# Altium project 宝宝驱动板_V8.PrjPcb
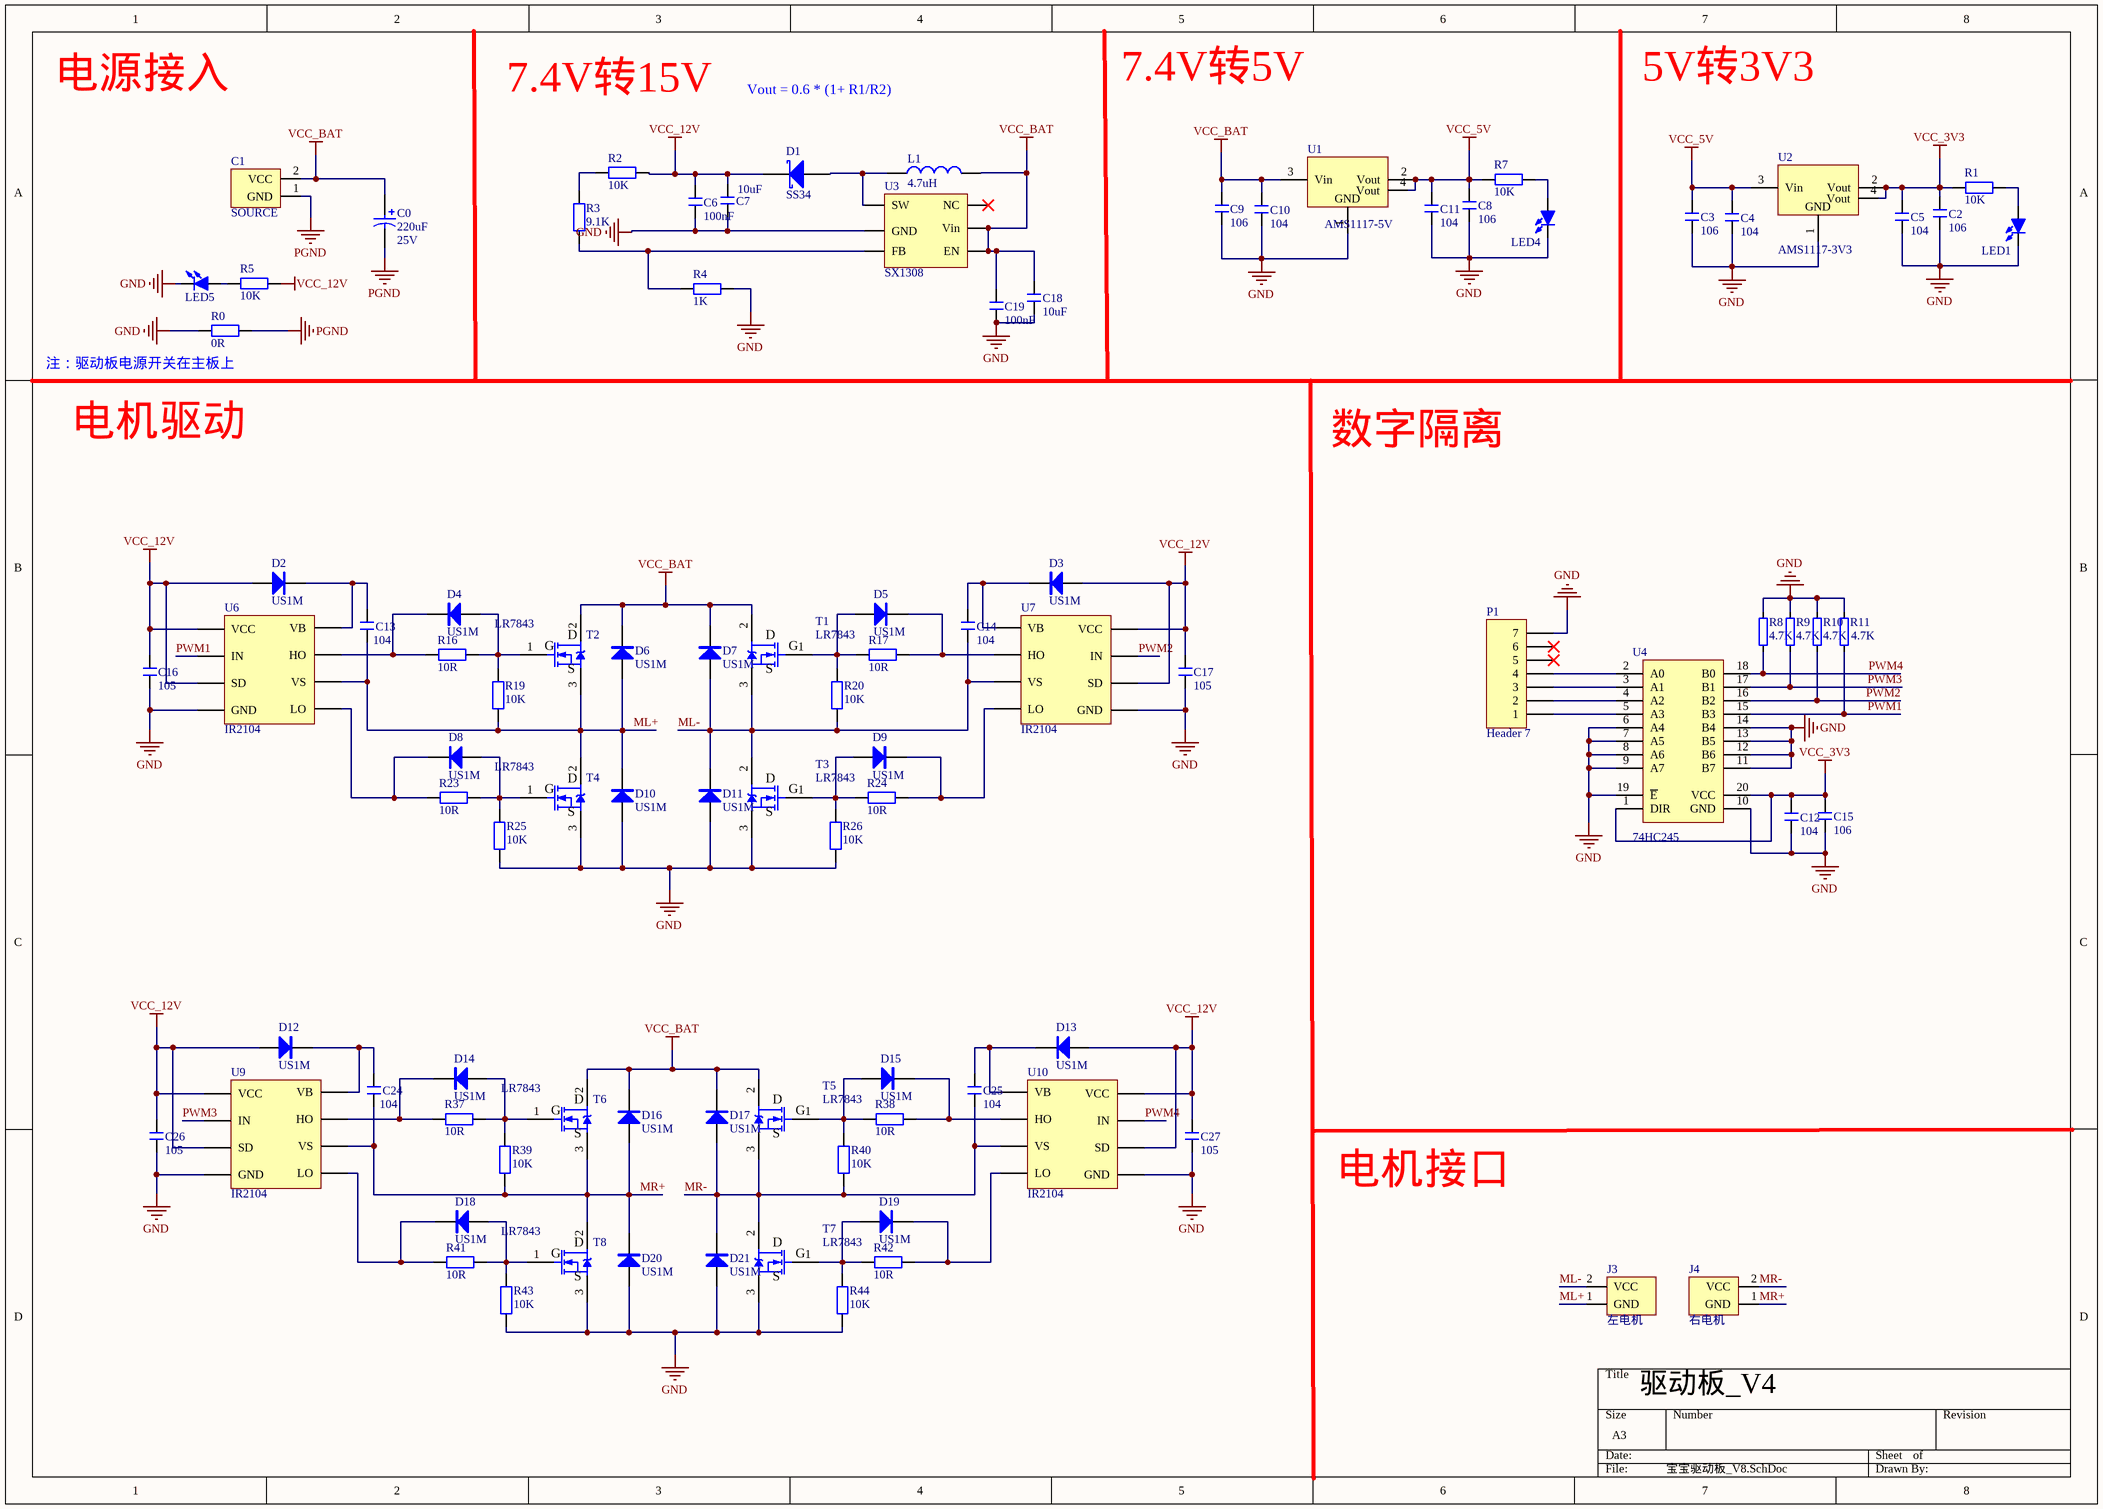
[diagram p0: 宝宝驱动板_V8.SchDoc]
1 sheet, 95 parts. Net scope: global (net labels, ports and power ports of the same name join across sheets).
Board file: 宝宝驱动板_V8.PcbDoc

## Sheet 宝宝驱动板_V8.SchDoc
size A3

### Parts
C0  value 220uF  Voltage: 25V  [CAPPR3.5-8X11.5]  (hidden comment: 220uF 25V)
C1  SOURCE  [KF128-5.08-2P]
C2  106  [C 0603_M]
C3  106  [C 0603_M]
C4  104  [C 0603_M]
C5  104  [C 0603_M]
C6  100nF  [C 0603_M]
C7  10uF  [C 0603_M]
C8  106  [C 0603_M]
C9  106  [C 0603_M]
C10  104  [C 0603_M]
C11  104  [C 0603_M]
C12  104  [C 0603_M]
C13  104  [C 0603_M]
C14  104  [C 0603_M]
C15  106  [C 0603_M]
C16  105  [C 0603_M]
C17  105  [C 0603_M]
C18  10uF  [C 0603_M]
C19  100nF  [C 0603_M]
C24  104  [C 0603_M]
C25  104  [C 0603_M]
C26  105  [C 0603_M]
C27  105  [C 0603_M]
D1  SS34  [SMA]
D2  US1M  [SMA]
D3  US1M  [SMA]
D4  US1M  [SMA]
D5  US1M  [SMA]
D6  US1M  [SMA]
D7  US1M  [SMA]
D8  US1M  [SMA]
D9  US1M  [SMA]
D10  US1M  [SMA]
D11  US1M  [SMA]
D12  US1M  [SMA]
D13  US1M  [SMA]
D14  US1M  [SMA]
D15  US1M  [SMA]
D16  US1M  [SMA]
D17  US1M  [SMA]
D18  US1M  [SMA]
D19  US1M  [SMA]
D20  US1M  [SMA]
D21  US1M  [SMA]
J3  左电机  [KF128-5.08-2P]
J4  右电机  [KF128-5.08-2P]
L1  4.7uH  [L 7*7]
LED1  红色  [LED 0603]  (value not drawn)
LED4  红色  [LED 0603]  (value not drawn)
LED5  红色  [LED 0603]  (value not drawn)
P1  Header 7  [PH2.0-L-Z-7P]
R0  value 0R  [R 2512_M]  (hidden comment: R)
R1  10K  [R 0603_M]
R2  10K  [R 0603_M]
R3  9.1K  [R 0603_M]
R4  1K  [R 0603_M]
R5  10K  [R 0603_M]
R7  10K  [R 0603_M]
R8  4.7K  [R 0603_M]
R9  4.7K  [R 0603_M]
R10  4.7K  [R 0603_M]
R11  4.7K  [R 0603_M]
R16  10R  [R 0603_M]
R17  10R  [R 0603_M]
R19  10K  [R 0603_M]
R20  10K  [R 0603_M]
R23  10R  [R 0603_M]
R24  10R  [R 0603_M]
R25  10K  [R 0603_M]
R26  10K  [R 0603_M]
R37  10R  [R 0603_M]
R38  10R  [R 0603_M]
R39  10K  [R 0603_M]
R40  10K  [R 0603_M]
R41  10R  [R 0603_M]
R42  10R  [R 0603_M]
R43  10K  [R 0603_M]
R44  10K  [R 0603_M]
T1  LR7843  [TO252]
T2  LR7843  [TO252]
T3  LR7843  [TO252]
T4  LR7843  [TO252]
T5  LR7843  [TO252]
T6  LR7843  [TO252]
T7  LR7843  [TO252]
T8  LR7843  [TO252]
U1  AMS1117-5V  [SOT223_L]
U2  AMS1117-3V3  [SOT223_L]
U3  SX1308  [SOT23-6]
U4  74HC245  [SOP20Z_M]
U6  IR2104  [SOP8]
U7  IR2104  [SOP8]
U9  IR2104  [SOP8]
U10  IR2104  [SOP8]

### Nets
GND: C2.1 C3.1 C4.1 C5.1 C6.1 C7.1 C8.1 C9.1 C10.1 C11.1 C12.1 C15.1 C16.1 C17.1 C18.1 C19.1 C26.1 C27.1 D10.1(A) D11.1(A) D20.1(A) D21.1(A) LED1.2(K) LED4.2(K) LED5.2(K) P1.7 R0.1 R4.1 R8.2 R9.2 R10.2 R11.2 R25.1 R26.1 R43.1 R44.1 T3.3(S) T4.3(S) T7.3(S) T8.3(S) U1.1(GND) U2.1(GND) U3.2(GND) U4.6(A4) U4.7(A5) U4.8(A6) U4.9(A7) U4.10(GND) U4.11(B7) U4.12(B6) U4.13(B5) U4.14(B4) U4.19(~{E}) U6.4(GND) U7.4(GND) U9.4(GND) U10.4(GND)
PGND: C0.2 C1.1(GND) R0.2
VCC_3V3: C2.2 C5.2 C12.2 C15.2 R1.1 U2.2(Vout) U2.4(Vout) U4.1(DIR) U4.20(VCC)
VCC_5V: C3.2 C4.2 C8.2 C11.2 R7.1 U1.2(Vout) U1.4(Vout) U2.3(Vin)
VCC_12V: C6.2 C7.2 C16.2 C17.2 C26.2 C27.2 D1.2(K) D2.1(A) D3.1(A) D12.1(A) D13.1(A) R2.2 R5.1 U6.1(VCC) U6.3(SD) U7.1(VCC) U7.3(SD) U9.1(VCC) U9.3(SD) U10.1(VCC) U10.3(SD)
VCC_BAT: C0.1 C1.2(VCC) C9.2 C10.2 C18.2 C19.2 D6.2(K) D7.2(K) D16.2(K) D17.2(K) L1.2 T1.2(D) T2.2(D) T5.2(D) T6.2(D) U1.3(Vin) U3.4(EN) U3.5(Vin)
ML+: C13.1 D6.1(A) D10.2(K) J3.1(GND) R19.1 T2.3(S) T4.2(D) U6.6(VS)
ML-: C14.1 D7.1(A) D11.2(K) J3.2(VCC) R20.1 T1.3(S) T3.2(D) U7.6(VS)
MR+: C24.1 D16.1(A) D20.2(K) J4.1(GND) R39.1 T6.3(S) T8.2(D) U9.6(VS)
MR-: C25.1 D17.1(A) D21.2(K) J4.2(VCC) R40.1 T5.3(S) T7.2(D) U10.6(VS)
PWM1: R11.1 U4.15(B3) U6.2(IN)
PWM2: R10.1 U4.16(B2) U7.2(IN)
PWM3: R9.1 U4.17(B1) U9.2(IN)
PWM4: R8.1 U4.18(B0) U10.2(IN)
NetC13_2: C13.2 D2.2(K) U6.8(VB)
NetC14_2: C14.2 D3.2(K) U7.8(VB)
NetC24_2: C24.2 D12.2(K) U9.8(VB)
NetC25_2: C25.2 D13.2(K) U10.8(VB)
NetD1_1: D1.1(A) L1.1 U3.1(SW)
NetD4_1: D4.1(A) R16.2 R19.2 T2.1(G)
NetD4_2: D4.2(K) R16.1 U6.7(HO)
NetD5_1: D5.1(A) R17.2 R20.2 T1.1(G)
NetD5_2: D5.2(K) R17.1 U7.7(HO)
NetD8_1: D8.1(A) R23.2 R25.2 T4.1(G)
NetD8_2: D8.2(K) R23.1 U6.5(LO)
NetD9_1: D9.1(A) R24.2 R26.2 T3.1(G)
NetD9_2: D9.2(K) R24.1 U7.5(LO)
NetD14_1: D14.1(A) R37.2 R39.2 T6.1(G)
NetD14_2: D14.2(K) R37.1 U9.7(HO)
NetD15_1: D15.1(A) R38.2 R40.2 T5.1(G)
NetD15_2: D15.2(K) R38.1 U10.7(HO)
NetD18_1: D18.1(A) R41.2 R43.2 T8.1(G)
NetD18_2: D18.2(K) R41.1 U9.5(LO)
NetD19_1: D19.1(A) R42.2 R44.2 T7.1(G)
NetD19_2: D19.2(K) R42.1 U10.5(LO)
NetLED1_1: LED1.1(A) R1.2
NetLED4_1: LED4.1(A) R7.2
NetLED5_1: LED5.1(A) R5.2
NetP1_1: P1.1 U4.5(A3)
NetP1_2: P1.2 U4.4(A2)
NetP1_3: P1.3 U4.3(A1)
NetP1_4: P1.4 U4.2(A0)
NetR2_1: R2.1 R3.1
NetR3_2: R3.2 R4.2 U3.3(FB)

Not connected (* = marked no-connect by the designer): P1 5* 6*; U3 6(NC)*

### Notes on the sheet
- 电源接入
- 7.4V转15V
- Vout = 0.6 * (1+ R1/R2)
- 7.4V转5V
- 5V转3V3
- 注：驱动板电源开关在主板上
- 电机驱动
- 数字隔离
- 电机接口
- 驱动板_V4

### Library data of the parts
C0 = Cap-Elect: Polarized Capacitor (Radial); Published: 8-Jun-2000; Revision: July-2002: Re-released for DXP Platform.; Publisher: Altium Limited; Price(RMB): 0.000
C1 = Source_端子
C2-C12 C15-C19 C26 C27 = C: 贴片电容; BOM名称: 无极性贴片电容; 淘宝ID: 封装库来自淘宝 ID：黄晶宝石; 联系售后，技术支持: https://shop463601444.taobao.com; 唯一出售店铺网址: https://shop463601444.taobao.com
C13 C14 C24 C25 = C: 贴片陶瓷电容 MLCC; BOM名称: 无极性贴片电容; 淘宝ID: 封装库来自淘宝 ID：黄晶宝石; 联系售后，技术支持: https://shop463601444.taobao.com; 唯一出售店铺网址: https://shop463601444.taobao.com
D1 = SS34: 肖特基二极管
D2-D21 = US1M: 快恢复二极管
J3 J4 = 接线端子
L1 = L: 功率电感
LED1 LED4 LED5 = LED: 贴片LED; 版权归属: 封装库来自淘宝 ID：黄晶宝石; BOM名称: 贴片LED; 学习资源: https://shop463601444.taobao.com
P1 = Header 7: Header, 7-Pin; LatestRevisionDate: 17-Jul-2002; LatestRevisionNote: Re-released for DXP Platform.; Publisher: Altium Limited
R0 = R: 贴片电阻; 版权归属: 电协硬件组
R1-R5 R7 R16 R17 R19 R20 R23-R26 R37-R44 = R: 贴片电阻; 版权归属: 来自淘宝 ID：黄晶宝石; 封装库来自淘宝卖家 ID：黄晶宝石: 其他店铺购入均为盗版，不享受售后技术支持服务，请立即申请退款; BOM名称: 贴片电阻; 联系售后: https://shop463601444.taobao.com
R8-R11 = RES
T1-T8 = SM3113NSUC: N-MOS
U1 U2 = AMS1117: 三端稳压芯片; BOM名称: 稳压芯片; 淘宝ID: 封装库来自淘宝 ID：黄晶宝石; 欢迎光临淘宝店铺: https://shop463601444.taobao.com
U3 = SX1308: DCDC升压芯片
U4 = 74HC245: 光耦隔离
U6 U7 U9 U10 = EG2104: 半桥驱动芯片